# Altium project EPS.PrjPcb (part 4 of 4)

## Sheet EPS_CTRL_B.SchDoc: CTRL-B
size A3; ApprovedBy: (not approved); CheckedBy: (not checked); Author: Piotr Kuligowski; DocumentNumber: PWSat2-xxx-DW-xxx; Revision: 3; SheetNumber: 24; SheetTotal: 51; Model: FPM
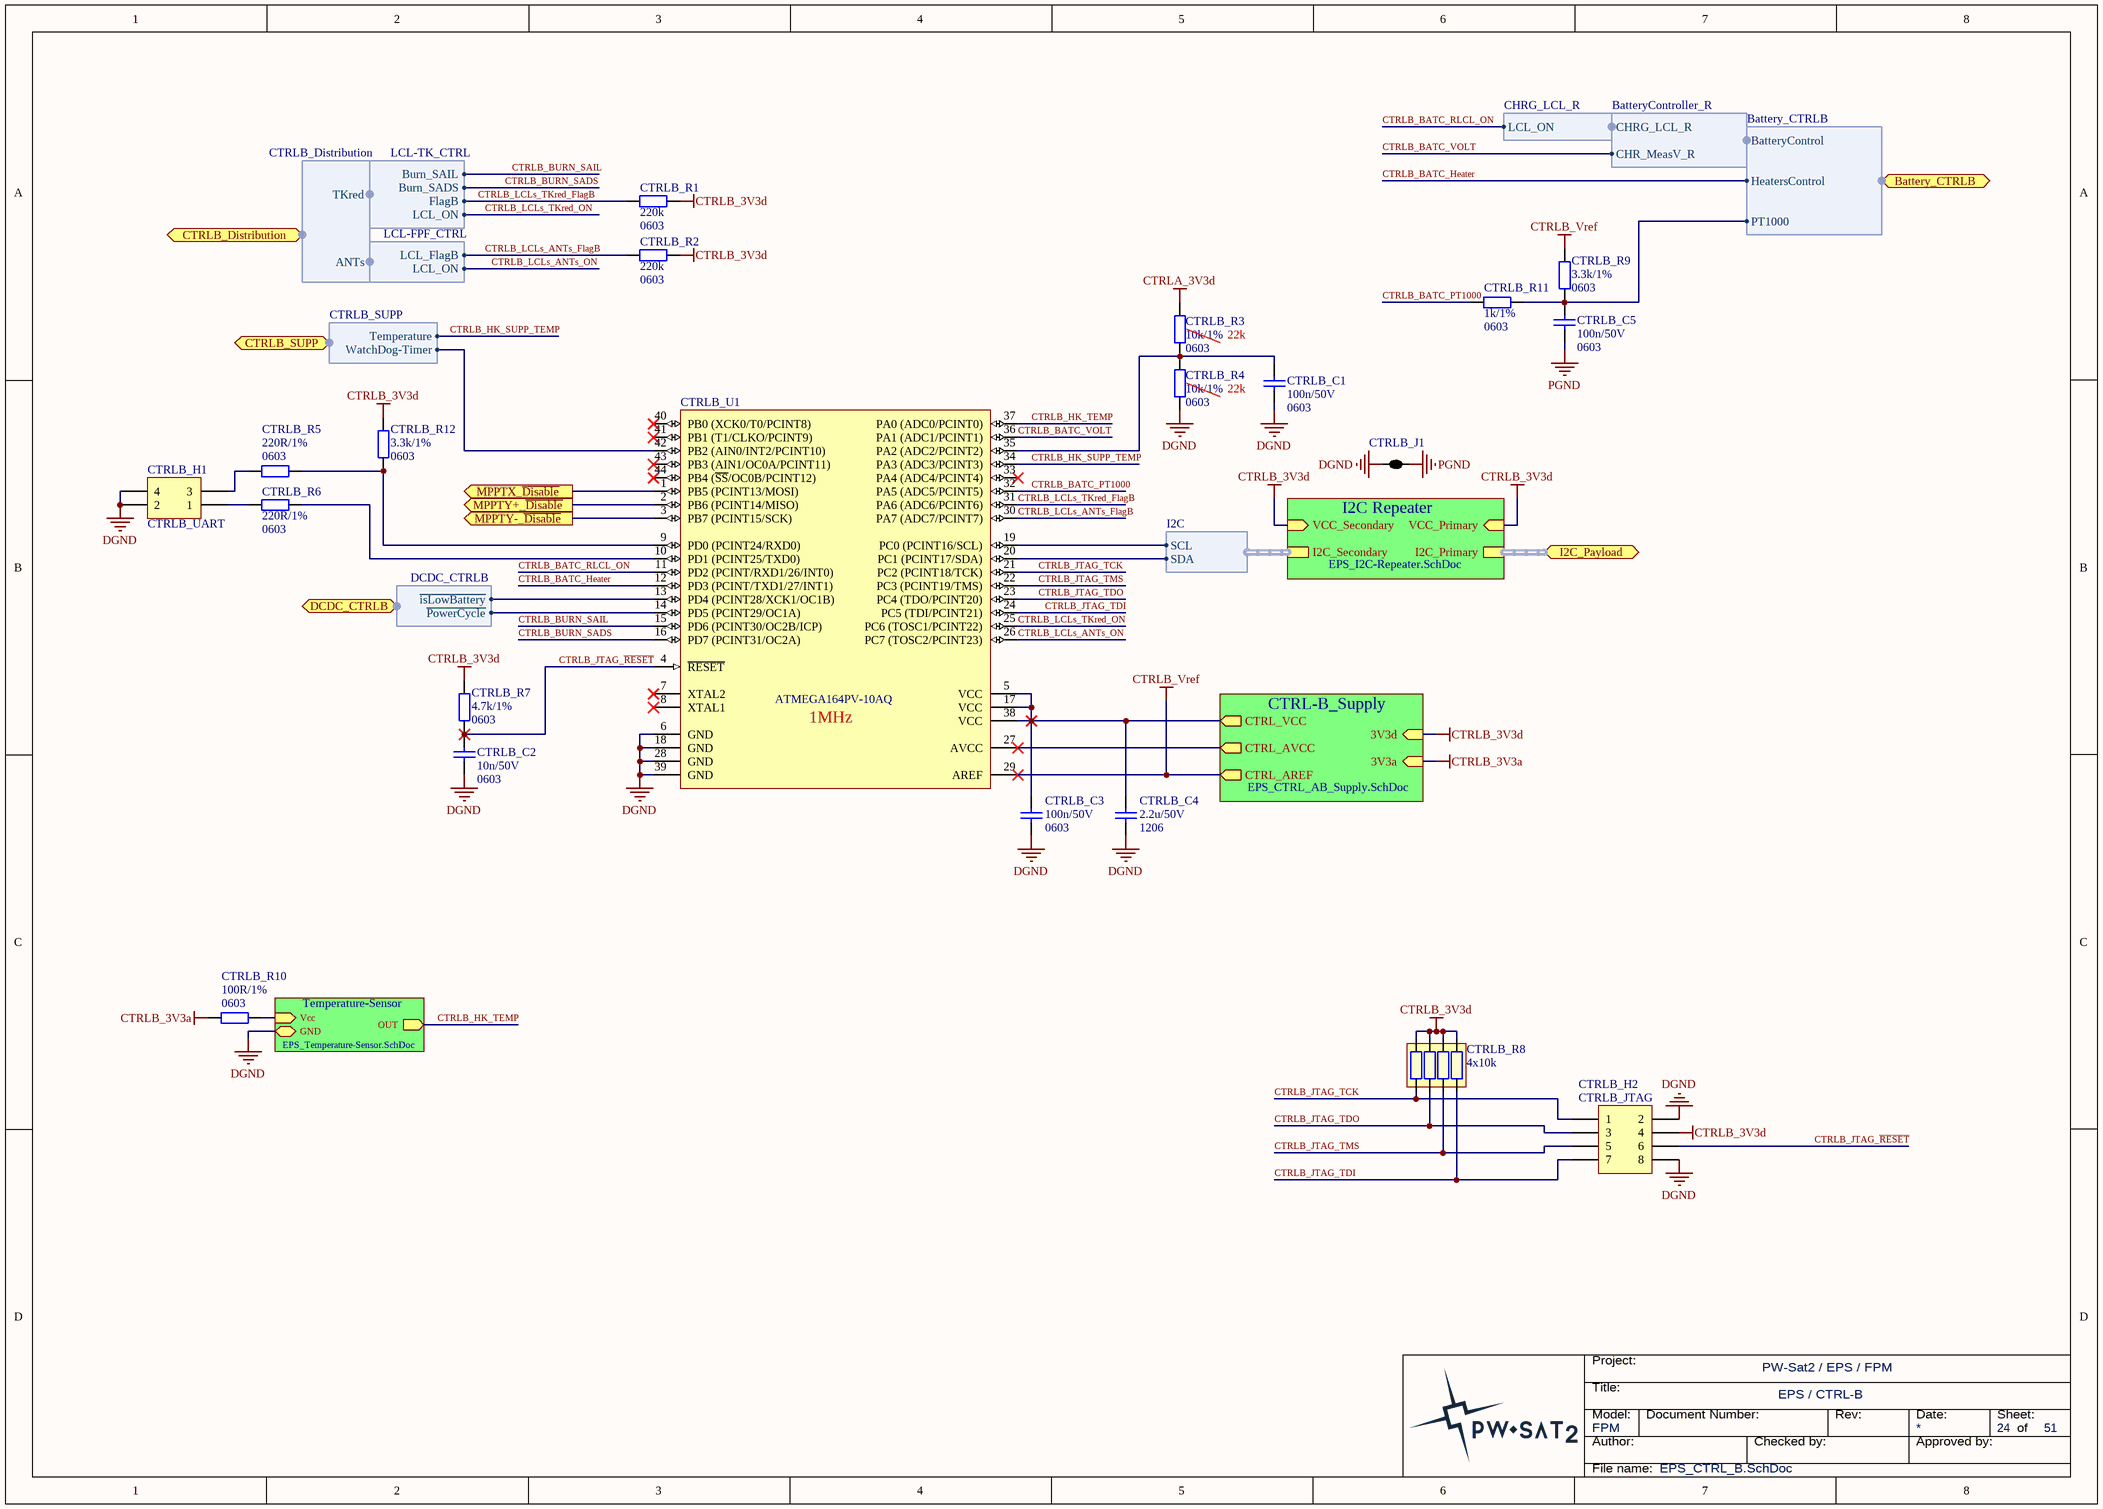
[diagram p38: EPS_CTRL_B.SchDoc]

### Parts
CTRLB_C1  Package: 0603  [SMD_Capacitor_0603]  (hidden comment: 100n/50V)
CTRLB_C2  Package: 0603  [SMD_Capacitor_0603]  (hidden comment: 10n/50V)
CTRLB_C3  Package: 0603  [SMD_Capacitor_0603]  (hidden comment: 100n/50V)
CTRLB_C4  Package: 1206  [SMD_Capacitor_1206]  (hidden comment: 2.2u/50V)
CTRLB_C5  Package: 0603  [SMD_Capacitor_0603]  (hidden comment: 100n/50V)
CTRLB_H1  CTRLB_UART  [Connfly_DS1031-04-2]
CTRLB_H2  CTRLB_JTAG  [Connfly_DS1031-08-2]
CTRLB_J1  2 way net tie junction  [2way_LP]  (value not drawn)  (net tie, no BOM)
CTRLB_R1  Package: 0603  [SMD_Resistor_0603]  (hidden comment: 220k)
CTRLB_R2  Package: 0603  [SMD_Resistor_0603]  (hidden comment: 220k)
CTRLB_R3  Package: 0603  [SMD_Resistor_0603]  (hidden comment: 10k/1%)
CTRLB_R4  Package: 0603  [SMD_Resistor_0603]  (hidden comment: 10k/1%)
CTRLB_R5  Package: 0603  [SMD_Resistor_0603]  (hidden comment: 220R/1%)
CTRLB_R6  Package: 0603  [SMD_Resistor_0603]  (hidden comment: 220R/1%)
CTRLB_R7  Package: 0603  [SMD_Resistor_0603]  (hidden comment: 4.7k/1%)
CTRLB_R8  4x10k  [SMD_RESISTOR_ARRAY_YC124]
CTRLB_R9  Package: 0603  [SMD_Resistor_0603]  (hidden comment: 3.3k/1%)
CTRLB_R10  Package: 0603  [SMD_Resistor_0603]  (hidden comment: 100R/1%)
CTRLB_R11  Package: 0603  [SMD_Resistor_0603]  (hidden comment: 1k/1%)
CTRLB_R12  Package: 0603  [SMD_Resistor_0603]  (hidden comment: 3.3k/1%)
CTRLB_U1  ATMEGA164PV-10AQ  [TQFP-44]

### Sub-sheets
CTRL-B_Supply = EPS_CTRL_AB_Supply.SchDoc: CTRL_VCC (out), CTRL_AVCC (out), CTRL_AREF (out), 3V3d (in), 3V3a (in)
I2C Repeater = EPS_I2C-Repeater.SchDoc: I2C_Primary (harness I2C), I2C_Secondary (harness I2C), VCC_Secondary (in), VCC_Primary (in)
Temperature-Sensor = EPS_Temperature-Sensor.SchDoc: OUT (out), Vcc (in), GND

### Ports
Battery_CTRLB (harness Battery_CTRLB), CTRLB_Distribution (harness CTRLB_Distribution), CTRLB_SUPP (harness CTRLB_SUPP), DCDC_CTRLB (harness DCDC_CTRLB), I2C_Payload (harness I2C), MPPTX_~{Disable} (out), MPPTY+_~{Disable} (out), MPPTY-_~{Disable} (out)

### Harnesses
I2C: SDA, SCL
DCDC_CTRLB: ~{PowerCycle}, ~{isLowBattery}
Battery_CTRLB: BatteryControl, HeatersControl, PT1000
BatteryController_R: CHRG_LCL_R, CHR_MeasV_R
CHRG_LCL_R: LCL_ON
CTRLB_Distribution: TKred, ANTs
LCL-TK_CTRL: FlagB, LCL_ON, Burn_SAIL, Burn_SADS
LCL-FPF_CTRL: LCL_FlagB, LCL_ON
CTRLB_SUPP: Temperature, WatchDog-Timer

### Nets
CTRLA_3V3d: CTRLB_R3.2
CTRLB_3V3a: CTRLB_R10.2 ; sheet CTRL-B_Supply/3V3a
CTRLB_3V3d: CTRLB_C3.1 CTRLB_C4.1 CTRLB_H2.4 CTRLB_R1.1 CTRLB_R2.1 CTRLB_R7.2 CTRLB_R8.1 CTRLB_R8.2 CTRLB_R8.3 CTRLB_R8.4 CTRLB_R12.2 CTRLB_U1.5(VCC) CTRLB_U1.17(VCC) CTRLB_U1.38(VCC) ; sheet I2C Repeater/VCC_Secondary, sheet I2C Repeater/VCC_Primary, sheet CTRL-B_Supply/CTRL_VCC, sheet CTRL-B_Supply/3V3d
CTRLB_Vref: CTRLB_R9.2 CTRLB_U1.29(AREF) ; sheet CTRL-B_Supply/CTRL_AREF
DGND: CTRLB_C1.2 CTRLB_C2.2 CTRLB_C3.2 CTRLB_C4.2 CTRLB_H1.2 CTRLB_H1.4 CTRLB_H2.2 CTRLB_H2.8 CTRLB_J1.2 CTRLB_R4.1 CTRLB_U1.6(GND) CTRLB_U1.18(GND) CTRLB_U1.28(GND) CTRLB_U1.39(GND) ; sheet Temperature-Sensor/GND
PGND: CTRLB_C5.2 CTRLB_J1.1
CTRLB_BATC_Heater: CTRLB_U1.12(PD3_(PCINT/TXD1/27/INT1)) ; port Battery_CTRLB.HeatersControl
CTRLB_BATC_PT1000: CTRLB_R11.2 CTRLB_U1.32(PA5_(ADC5/PCINT5))
CTRLB_BATC_RLCL_ON: CTRLB_U1.11(PD2_(PCINT/RXD1/26/INT0)) ; harness CHRG_LCL_R.LCL_ON  [project net CHRG_LCLR_ON]
CTRLB_BATC_VOLT: CTRLB_U1.36(PA1_(ADC1/PCINT1)) ; harness BatteryController_R.CHR_MeasV_R  [project net BAT_MEAS_VOLTAGE_R]
CTRLB_BURN_SADS: CTRLB_U1.16(PD7_(PCINT31/OC2A)) ; harness LCL-TK_CTRL.Burn_SADS
CTRLB_BURN_SAIL: CTRLB_U1.15(PD6_(PCINT30/OC2B/ICP)) ; harness LCL-TK_CTRL.Burn_SAIL
CTRLB_HK_SUPP_TEMP: CTRLB_U1.34(PA3_(ADC3/PCINT3)) ; port CTRLB_SUPP.Temperature
CTRLB_HK_TEMP: CTRLB_U1.37(PA0_(ADC0/PCINT0)) ; sheet Temperature-Sensor/OUT
CTRLB_JTAG_~{RESET}: CTRLB_C2.1 CTRLB_H2.6 CTRLB_R7.1 CTRLB_U1.4(~{RESET})
CTRLB_JTAG_TCK: CTRLB_H2.1 CTRLB_R8.8 CTRLB_U1.21(PC2_(PCINT18/TCK))
CTRLB_JTAG_TDI: CTRLB_H2.7 CTRLB_R8.5 CTRLB_U1.24(PC5_(TDI/PCINT21))
CTRLB_JTAG_TDO: CTRLB_H2.3 CTRLB_R8.7 CTRLB_U1.23(PC4_(TDO/PCINT20))
CTRLB_JTAG_TMS: CTRLB_H2.5 CTRLB_R8.6 CTRLB_U1.22(PC3_(PCINT19/TMS))
CTRLB_LCLs_ANTs_FlagB: CTRLB_R2.2 CTRLB_U1.30(PA7_(ADC7/PCINT7)) ; harness LCL-FPF_CTRL.LCL_FlagB
CTRLB_LCLs_ANTs_ON: CTRLB_U1.26(PC7_(TOSC2/PCINT23)) ; harness LCL-FPF_CTRL.LCL_ON
CTRLB_LCLs_TKred_FlagB: CTRLB_R1.2 CTRLB_U1.31(PA6_(ADC6/PCINT6)) ; harness LCL-TK_CTRL.FlagB
CTRLB_LCLs_TKred_ON: CTRLB_U1.25(PC6_(TOSC1/PCINT22)) ; harness LCL-TK_CTRL.LCL_ON
NetCTRL_C3_2_1: CTRLB_U1.27(AVCC) ; sheet CTRL-B_Supply/CTRL_AVCC
NetCTRLB_C1_1: CTRLB_C1.1 CTRLB_R3.1 CTRLB_R4.2 CTRLB_U1.35(PA2_(ADC2/PCINT2))
NetCTRLB_C5_1: CTRLB_C5.1 CTRLB_R9.1 CTRLB_R11.1 ; port Battery_CTRLB.PT1000
NetCTRLB_H1_1: CTRLB_H1.1 CTRLB_R6.1
NetCTRLB_H1_3: CTRLB_H1.3 CTRLB_R5.1
NetCTRLB_R5_2: CTRLB_R5.2 CTRLB_R12.1 CTRLB_U1.9(PD0_(PCINT24/RXD0))
NetCTRLB_R6_2: CTRLB_R6.2 CTRLB_U1.10(PD1_(PCINT25/TXD0))
NetCTRLB_R10_1: CTRLB_R10.1 ; sheet Temperature-Sensor/Vcc
NetCTRLB_U1_1: CTRLB_U1.1(PB5_(PCINT13/MOSI)) ; port MPPTX_~{Disable}
NetCTRLB_U1_2: CTRLB_U1.2(PB6_(PCINT14/MISO)) ; port MPPTY+_~{Disable}
NetCTRLB_U1_3: CTRLB_U1.3(PB7_(PCINT15/SCK)) ; port MPPTY-_~{Disable}
NetCTRLB_U1_13: CTRLB_U1.13(PD4_(PCINT28/XCK1/OC1B)) ; port DCDC_CTRLB.~{isLowBattery}
NetCTRLB_U1_14: CTRLB_U1.14(PD5_(PCINT29/OC1A)) ; port DCDC_CTRLB.~{PowerCycle}
NetCTRLB_U1_19: CTRLB_U1.19(PC0_(PCINT16/SCL)) ; sheet I2C Repeater/I2C_Secondary.SCL
NetCTRLB_U1_20: CTRLB_U1.20(PC1_(PCINT17/SDA)) ; sheet I2C Repeater/I2C_Secondary.SDA
NetCTRLB_U1_42: CTRLB_U1.42(PB2_(AIN0/INT2/PCINT10)) ; port CTRLB_SUPP.WatchDog-Timer

Not connected (* = marked no-connect by the designer): CTRLB_U1 7(XTAL2)* 8(XTAL1)* 33(PA4_(ADC4/PCINT4))* 40(PB0_(XCK0/T0/PCINT8))* 41(PB1_(T1/CLKO/PCINT9))* 43(PB3_(AIN1/OC0A/PCINT11))* 44(PB4_(~{SS}/OC0B/PCINT12))*

### Buses and harness runs
harness port I2C_Payload = sheet I2C Repeater/I2C_Primary

### Notes on the sheet
- 22k
- (near CTRLB_U1) 1MHz
- Title:
- Project:
- Author:
- Model:
- Document Number:
- Checked by:
- Rev:
- Date:
- Approved by:
- Sheet:
- of
- File name:

### Library data of the parts
CTRLB_C1-CTRLB_C3 CTRLB_C5 = Cer_C0603T104K5RALTU: Ceramic Cap Kemet COTS 100n/50V X7R 0603; Manufacturer: Kemet; ManufacturerPartNumber: C0603T104K5RALTU
  CTRLB_C1 CTRLB_C3 CTRLB_C5: Value: 100n/50V
  CTRLB_C2: Value: 10n/50V
CTRLB_C4 = Cer_GCJ31CR71H225KA12L: Ceramic Cap Murata Automotive 2.2u/50V X7R 1206; Manufacturer: Murata; ManufacturerPartNumber: GCJ31CR71H225KA12L; Value: 2.2u/50V
CTRLB_H1 = Header 2X2: Header, 2-Pin, Dual row; LatestRevisionDate: 17-Jul-2002; LatestRevisionNote: Re-released for DXP Platform.; Publisher: Altium Limited
CTRLB_H2 = Header 4X2: Header, 4-Pin, Dual row; LatestRevisionDate: 17-Jul-2002; LatestRevisionNote: Re-released for DXP Platform.; Publisher: Altium Limited
CTRLB_J1 = 2way: ComponentLink1URL: http://www.edatools.cz/addons; ComponentLink1Description: Source; FootprintNote: LP=12mil, MP=40mil, HP=120mil
CTRLB_R1-CTRLB_R7 CTRLB_R9 CTRLB_R11 CTRLB_R12 = CRCW06034K70FKxxxx: 4.7k/1% Vishay CRCW 0603 Resistor. 100mW, 100ppm, 75V.; Manufacturer: Vishay; ManufactuerPartNumber: CRCW06034K70FKxxxx
  CTRLB_R1 CTRLB_R2: Value: 220k
  CTRLB_R3 CTRLB_R4: Value: 10k/1%
  CTRLB_R5 CTRLB_R6: Value: 220R/1%
  CTRLB_R7: Value: 4.7k/1%
  CTRLB_R9 CTRLB_R12: Value: 3.3k/1%
  CTRLB_R11: Value: 1k/1%
CTRLB_R8 = YC124-JR-072K2L: RESISTOR ARRAY, 4 x 0402; URL: http://pl.farnell.com/yageo-phycomp/yc124-jr-072k2l/resistor-array-arv341-4-x-0402/dp/9235388
CTRLB_R10 = CRCW06031K00FKxxxx: 1k/1% Vishay CRCW 0603 Resistor. 100mW, 100ppm, 75V.; Manufacturer: Vishay; ManufacturerPartNumber: CRCW06031K00FKxxxx; Value: 100R/1%
CTRLB_U1 = ATMEGA164PV-10AQ: General-purpose microcontroller; Value: ATMEGA164PV-10AQ

## Sheet EPS_Connectors_PC-104.SchDoc: Connectors / PC-104
size A4; ApprovedBy: (not approved); CheckedBy: (not checked); Author: Piotr Kuligowski; DocumentNumber: PWSat2-xxx-DW-xxx; Revision: 3; SheetNumber: 2; SheetTotal: 51; Model: FPM
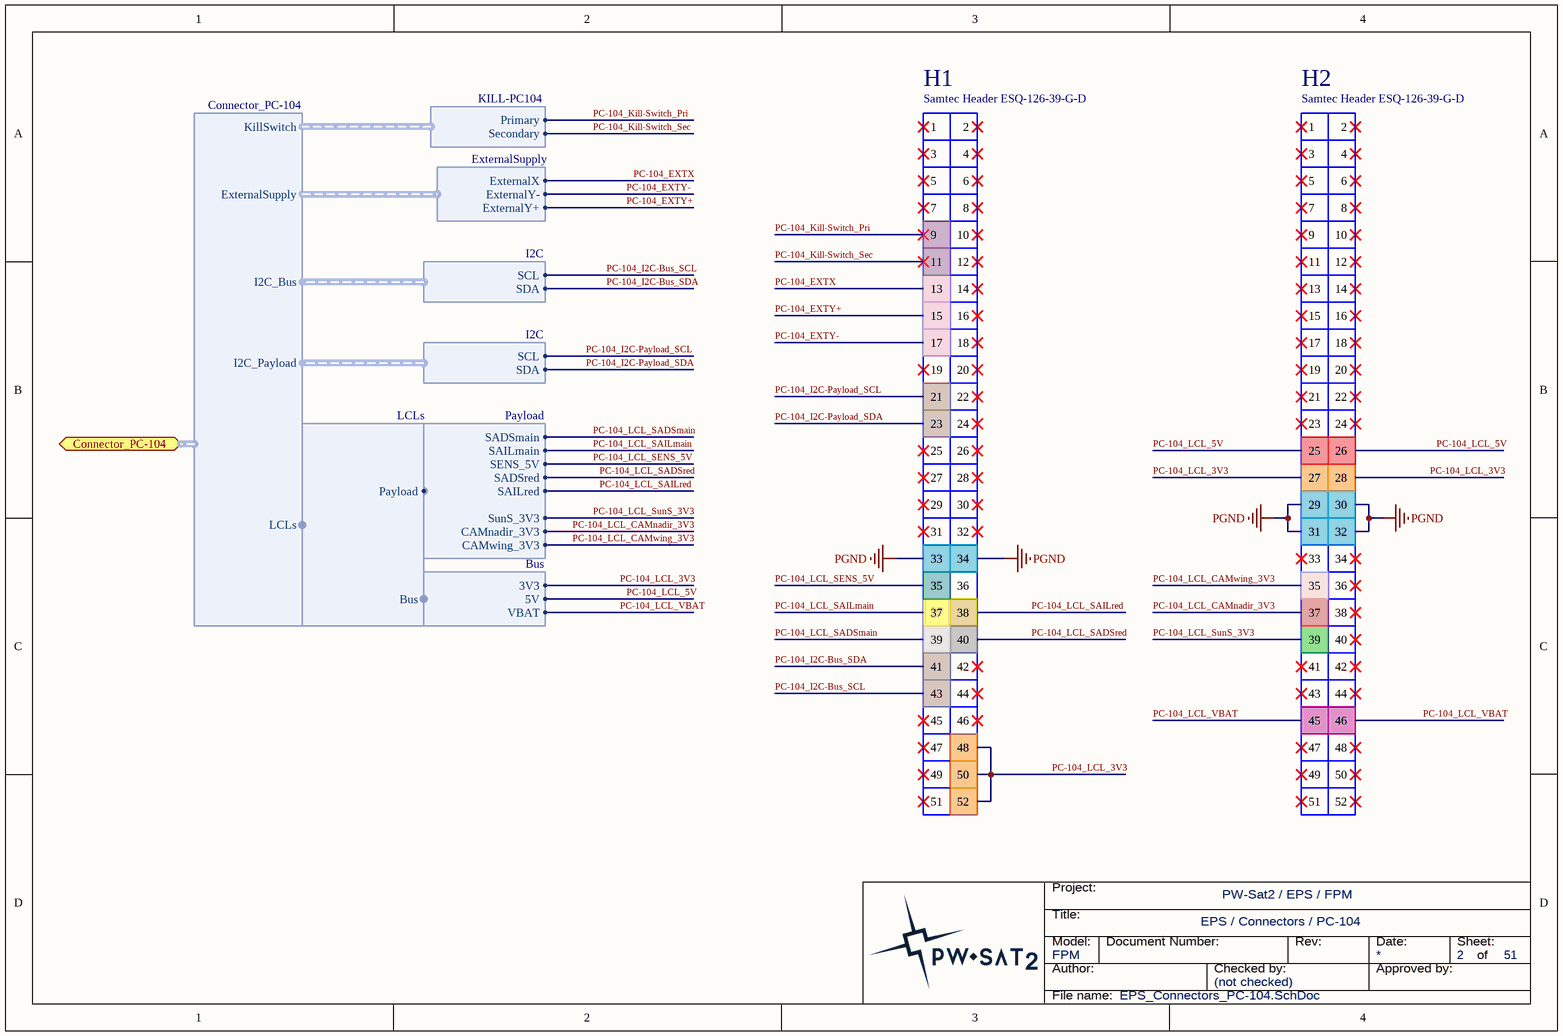
[diagram p39: EPS_Connectors_PC-104.SchDoc]

### Parts
H1  Samtec Header ESQ-126-39-G-D  [Samtec_ESQ-126-39-G-D]
H2  Samtec Header ESQ-126-39-G-D  [Samtec_ESQ-126-39-G-D]

### Ports
Connector_PC-104 (harness Connector_PC-104)

### Harnesses
Connector_PC-104: I2C_Payload, LCLs, I2C_Bus, ExternalSupply, KillSwitch
Payload: SADSred, SAILred, SENS_5V, SAILmain, SADSmain, SunS_3V3, CAMnadir_3V3, CAMwing_3V3
I2C: SDA, SCL
LCLs: Payload, Bus
Bus: 3V3, 5V, VBAT
ExternalSupply: ExternalX, ExternalY-, ExternalY+
KILL-PC104: Secondary, Primary

### Nets
PGND: H1.33 H1.34 H2.29 H2.30 H2.31 H2.32
PC-104_EXTX: H1.13 ; harness ExternalSupply.ExternalX
PC-104_EXTY+: H1.15 ; harness ExternalSupply.ExternalY+
PC-104_EXTY-: H1.17 ; harness ExternalSupply.ExternalY-
PC-104_I2C-Bus_SCL: H1.43 ; harness I2C.SCL
PC-104_I2C-Bus_SDA: H1.41 ; harness I2C.SDA
PC-104_I2C-Payload_SCL: H1.21 ; harness I2C.SCL
PC-104_I2C-Payload_SDA: H1.23 ; harness I2C.SDA
PC-104_Kill-Switch_Pri: H1.9 ; harness KILL-PC104.Primary
PC-104_Kill-Switch_Sec: H1.11 ; harness KILL-PC104.Secondary
PC-104_LCL_3V3: H1.48 H1.50 H1.52 H2.27 H2.28 ; harness Bus.3V3
PC-104_LCL_5V: H2.25 H2.26 ; harness Bus.5V
PC-104_LCL_CAMnadir_3V3: H2.37 ; harness Payload.CAMnadir_3V3
PC-104_LCL_CAMwing_3V3: H2.35 ; harness Payload.CAMwing_3V3
PC-104_LCL_SADSmain: H1.39 ; harness Payload.SADSmain
PC-104_LCL_SADSred: H1.40 ; harness Payload.SADSred
PC-104_LCL_SAILmain: H1.37 ; harness Payload.SAILmain
PC-104_LCL_SAILred: H1.38 ; harness Payload.SAILred
PC-104_LCL_SENS_5V: H1.35 ; harness Payload.SENS_5V
PC-104_LCL_SunS_3V3: H2.39 ; harness Payload.SunS_3V3
PC-104_LCL_VBAT: H2.45 H2.46 ; harness Bus.VBAT

Not connected (* = marked no-connect by the designer): H1 1* 2* 3* 4* 5* 6* 7* 8* 10* 12* 14* 16* 18* 19* 20* 22* 24* 25* 26* 27* 28* 29* 30* 31* 32* 36 42* 44* 45* 46* 47* 49* 51*; H2 1* 2* 3* 4* 5* 6* 7* 8* 9* 10* 11* 12* 13* 14* 15* 16* 17* 18* 19* 20* 21* 22* 23* 24* 33* 34* 36* 38* 40* 41* 42* 43* 44* 47* 48* 49* 50* 51* 52*

### Notes on the sheet
- Title:
- Project:
- Author:
- Model:
- Document Number:
- Checked by:
- Rev:
- Date:
- Approved by:
- Sheet:
- of
- File name:

### Library data of the parts
H1 H2 = Samtec_ESQ-126-xx-x-D: Samtec ESQ Series Header , 2.54mm pitch, 2x26pin. PC-104 Stack Connector.; HelpUrl: http://suddendocs.samtec.com/catalog_english/esq_th.pdf; Value: Samtec Header ESQ-126-39-G-D

## Nets that join several sheets
AGND: Top/MPPT X/MPPTX Interface to uC (18 pins), Top/MPPT Y+/MPPTY Interface to uC (18 pins), Top/MPPT Y-/MPPTY Interface to uC (18 pins)
CTRLA_3V3a: EPS_CTRL_A (8 pins), Top/Controller A/CTRL-A_Supply (CTRL_FB1_1.1 CTRL_FB2_1.1), Top/MPPT X/MPPTX Measurements (MEAS_R3_1.1), Top/MPPT Y+/MPPTY Measurements (MEAS_R3_2.1), EPS_3V3 (TEMP_R4.2), EPS_5V (TEMP_R1.2), Top/Distribution/5V Measurements (HK_R2_1.1), Top/Distribution/3V3 Measurements (HK_R2_2.1), Top/Distribution/VBAT Measurements (HK_R2_3.1), Top/Local-Supply and WDTs/Local-Supply CTRL-A (LS_FB1_1.2 SUPP_C1_1.1 SUPP_C2_1.1 TEMP_R5_1.2), EPS_Battery (TEMP_R2.2), Top/MPPT Y-/MPPTY Measurements (MEAS_R3_3.1)
CTRLA_3V3d: EPS_CTRL_A (20 pins), Top/Controller A/I2C Repeater (9 pins), Top/Controller A/CTRL-A_Supply (CTRL_C1_1.1 CTRL_C2_1.1 CTRL_C8_1.1 CTRL_C9_1.1), EPS_DCDC_RLCLs (SEL_C2.1 SEL_R10.2 SEL_U1.5), EPS_Local-Supply (LS_D1.A LS_R9.2), Top/Local-Supply and WDTs/Local-Supply CTRL-A (SUPP_C5_1.1 SUPP_C6_1.1 SUPP_R2_1.1 SUPP_U3_1.6), EPS_Battery_Controller_Current-Meas (BATC_R3.1 BATC_R4.1), EPS_Battery_Heaters-Control (HTR_R1.2), EPS_CTRL_B (CTRLB_R3.2)
CTRLAB_3V3d: Top/Distribution/LCL-FPF SunS 3V3 (LCL_R2_1.1), Top/Distribution/LCL-FPF CAMnadir 3V3 (LCL_R2_2.1), Top/Distribution/LCL-FPF CAMwing 3V3 (LCL_R2_3.1), Top/Distribution/LCL-TK MAIN (LCLTK_R6_1.1), Top/Distribution/LCL-TK Redundant (LCLTK_R6_2.1), Top/Distribution/LCL-FPF SENS 5V (LCL_R2_4.1), Top/Distribution/LCL-FPF ANTs 5V (LCL_R2_5.1), Top/Distribution/LCL-FPF ANTs 5V (LCL_R2_6.1), EPS_DCDC_RLCLs (SEL_R1.2), EPS_Local-Supply (LS_R7.2 LS_R8.1 LS_R10.2), EPS_Battery_Controller_RLCL (RLCLB_R1.2)
CTRLB_3V3a: Top/Local-Supply and WDTs/Local-Supply CTRL-B (LS_FB1_2.2 SUPP_C1_2.1 SUPP_C2_2.1 TEMP_R5_2.2), EPS_CTRL_B (CTRLB_R10.2), Top/Controller B/CTRL-B_Supply (CTRL_FB1_2.1 CTRL_FB2_2.1)
CTRLB_3V3d: EPS_CTRL_A (CTRLA_R14.2), EPS_DCDC_RLCLs (SEL_C3.1 SEL_R11.2 SEL_U2.5), EPS_Local-Supply (LS_D2.A LS_R11.2), Top/Local-Supply and WDTs/Local-Supply CTRL-B (SUPP_C5_2.1 SUPP_C6_2.1 SUPP_R2_2.1 SUPP_U3_2.6), EPS_Battery_Heaters-Control (HTR_R7.2), EPS_CTRL_B (14 pins), Top/Controller B/I2C Repeater (9 pins), Top/Controller B/CTRL-B_Supply (CTRL_C1_2.1 CTRL_C2_2.1 CTRL_C8_2.1 CTRL_C9_2.1)
CTRLB_Vref: EPS_CTRL_B (CTRLB_R9.2 CTRLB_U1.29), Top/Controller B/CTRL-B_Supply (CTRL_C5_2.1 CTRL_C6_2.1 CTRL_R1_2.1 CTRL_REF1_2.1)
DGND: EPS_CTRL_A (21 pins), Top/Controller A/I2C Repeater (5 pins), Top/Controller A/CTRL-A_Supply (12 pins), Top/Controller A/Temperature-Sensor (TEMP_C1_1.2 TEMP_U1_1.2), Top/Distribution/5V Measurements (HK_C4_1.2), Top/Distribution/3V3 Measurements (HK_C4_2.2), Top/Distribution/VBAT Measurements (HK_C4_3.2), EPS_Local-Supply (LS_R9.1 LS_R10.1 LS_R11.1), EPS_CTRL_B (14 pins), Top/Controller B/I2C Repeater (5 pins), Top/Controller B/Temperature-Sensor (TEMP_C1_7.2 TEMP_U1_7.2), Top/Controller B/CTRL-B_Supply (12 pins)
PGND: EPS_Connectors (20 pins), Top/Controller A/CTRL-A_Supply (CTRL_J1_1.1), EPS_MPPT_X_Boost-Converter (13 pins), Top/MPPT X/MPPTX Interface to uC (MPPT_C10_1.2 MPPT_J1_1.1 MPPT_U4_1.2), Top/MPPT X/MPPTX Measurements (5 pins), EPS_MPPT_X_EMI-Filter_In (EMIXI_C1.2 EMIXI_C2.2), EPS_MPPT_X_OR_MPB (SUMPBX_C4.2 SUMPBX_R4.2 SUMPBX_R6.2), Top/MPPT Y+/MPPTY Buck-Boost Converter (20 pins), Top/MPPT Y+/MPPTY EMI Filters for Solar Panels (EMIYS_C1_1.2 EMIYS_C2_1.2 EMIYS_T1_1.3), Top/MPPT Y+/MPPTY Interface to uC (MPPT_C10_2.2 MPPT_J1_2.1 MPPT_U4_2.2), Top/MPPT Y+/MPPTY Measurements (5 pins), Top/MPPT Y+/MPPTY Input EMI Filter (EMIYI_C1_1.2 EMIYI_C2_1.2), Top/MPPT Y+/MPPTY Output EMI Filter (EMIYO_C1_1.2 EMIYO_C2_1.2 EMIYO_C3_1.2), Top/MPPT Y+/MPPTY ORing to MPB (5 pins), Top/3V3/Temperature-Sensor (TEMP_C1_2.2 TEMP_U1_2.2), EPS_5V_EMI-Filter_Out (EMIBB_C2.2 EMIBB_C3.2 EMIBB_C4.2), Top/5V/Temperature-Sensor (TEMP_C1_3.2 TEMP_U1_3.2), EPS_RBL (RBL_C2.2 RBL_C4.2 RBL_Q2.E RBL_Q4.E), EPS_Distribution (8 pins), Top/Distribution/LCL-FPF SunS 3V3 (LCL_C2_1.2 LCL_C3_1.2 LCL_R3_1.1 LCL_R5_1.1), Top/Distribution/LCL-FPF CAMnadir 3V3 (LCL_C2_2.2 LCL_C3_2.2 LCL_R3_2.1 LCL_R5_2.1), Top/Distribution/LCL-FPF CAMwing 3V3 (LCL_C2_3.2 LCL_C3_3.2 LCL_R3_3.1 LCL_R5_3.1), Top/Distribution/LCL-TK MAIN (10 pins), Top/Distribution/LCL-TK Redundant (10 pins), Top/Distribution/LCL-FPF SENS 5V (LCL_C2_4.2 LCL_C3_4.2 LCL_R3_4.1 LCL_R5_4.1), Top/Distribution/RLCL-FPF 5V (6 pins), Top/Distribution/5V Measurements (5 pins), Top/Distribution/3V3 Measurements (5 pins), Top/Distribution/VBAT Measurements (5 pins), Top/Distribution/LCL-FPF ANTs 5V (LCL_C2_5.2 LCL_C3_5.2 LCL_R3_5.1 LCL_R5_5.1), Top/Distribution/RLCL-FPF 3V3 (6 pins), Top/Distribution/LCL-FPF ANTs 5V (LCL_C2_6.2 LCL_C3_6.2 LCL_R3_6.1 LCL_R5_6.1), EPS_DCDC_RLCLs (13 pins), Top/LCLs for DCDC/DCDC RLCL (DRLCL_C4_1.2 DRLCL_C5_1.2 DRLCL_R4_1.1 DRLCL_R5_1.2), Top/LCLs for DCDC/VBAT RLCL (DRLCL_C4_2.2 DRLCL_C5_2.2 DRLCL_R4_2.1 DRLCL_R5_2.2), EPS_Local-Supply (LS_C2.2 LS_R4.2), Top/Local-Supply and WDTs/Local-Supply CTRL-A (18 pins), Top/Local-Supply and WDTs/Local-Supply CTRL-A/Temperature-Sensor (TEMP_C1_4.2 TEMP_U1_4.2), Top/Local-Supply and WDTs/Local-Supply CTRL-B (18 pins), Top/Local-Supply and WDTs/Local-Supply CTRL-B/Temperature-Sensor (TEMP_C1_5.2 TEMP_U1_5.2), EPS_Battery_Controller_Current-Meas (BATC_R2.2 BATC_R5.1), EPS_Battery_Controller_Voltage-Meas (BATV_C1.2 BATV_C2.2 BATV_R2.2 BATV_R4.2), EPS_Battery_Controller_RLCL (9 pins), EPS_Battery_Heaters-Control (HTR_Q2.E HTR_Q3.S HTR_R3.1), Top/Battery Pack/Temperature-Sensor (TEMP_C1_6.2 TEMP_U1_6.2), Top/MPPT Y-/MPPTY Buck-Boost Converter (20 pins), Top/MPPT Y-/MPPTY EMI Filters for Solar Panels (EMIYS_C1_2.2 EMIYS_C2_2.2 EMIYS_T1_2.3), Top/MPPT Y-/MPPTY Interface to uC (MPPT_C10_3.2 MPPT_J1_3.1 MPPT_U4_3.2), Top/MPPT Y-/MPPTY Measurements (5 pins), Top/MPPT Y-/MPPTY Input EMI Filter (EMIYI_C1_2.2 EMIYI_C2_2.2), Top/MPPT Y-/MPPTY Output EMI Filter (EMIYO_C1_2.2 EMIYO_C2_2.2 EMIYO_C3_2.2), Top/MPPT Y-/MPPTY ORing to MPB (5 pins), EPS_CTRL_B (CTRLB_C5.2 CTRLB_J1.1), Top/Controller B/CTRL-B_Supply (CTRL_J1_2.1), EPS_Connectors_PC-104 (6 pins)
BAT_MEAS_VOLTAGE_N: EPS_CTRL_A (CTRLA_U3.10), EPS_Battery_Controller_Voltage-Meas (BATV_C1.1 BATV_R1.2 BATV_R2.1)
BAT_MEAS_VOLTAGE_R: EPS_Battery_Controller_Voltage-Meas (BATV_C2.1 BATV_R3.2 BATV_R4.1), EPS_CTRL_B (CTRLB_U1.36)
CHRG_LCLN_ON: EPS_CTRL_A (U4.33), EPS_Battery_Controller_RLCL (RLCLB_R10.1)
CHRG_LCLR_ON: EPS_Battery_Controller_RLCL (RLCLB_R9.1), EPS_CTRL_B (CTRLB_U1.11)
CHRG_MEAS_CURRENT: EPS_CTRL_A (CTRLA_U3.12), EPS_Battery_Controller_Current-Meas (BATC_U1.2)
CTRLA_BATC_CURR_DCHRG: EPS_CTRL_A (CTRLA_U3.11), EPS_Battery_Controller_Current-Meas (BATC_U2.2)
CTRLA_BATC_Heater: EPS_CTRL_A (U4.34), EPS_Battery_Heaters-Control (HTR_R8.2)
CTRLA_BATC_TEMP: EPS_CTRL_A (CTRLA_U3.13), Top/Battery Pack/Temperature-Sensor (TEMP_R1_6.2)
CTRLA_BURN_SADS: EPS_CTRL_A (U4.42), Top/Distribution/LCL-TK MAIN (LCLTK_R11_1.2 LCLTK_R12_1.2)
CTRLA_BURN_SAIL: EPS_CTRL_A (U4.41), Top/Distribution/LCL-TK MAIN (LCLTK_R3_1.2 LCLTK_R5_1.2)
CTRLA_HK_3V3_CURR: EPS_CTRL_A (CTRLA_U2.6), Top/Distribution/3V3 Measurements (HK_C4_2.1 HK_R5_2.2)
CTRLA_HK_3V3_TEMP: EPS_CTRL_A (CTRLA_U2.11), Top/3V3/Temperature-Sensor (TEMP_R1_2.2)
CTRLA_HK_3V3_VOLT: EPS_CTRL_A (CTRLA_U2.7), Top/Distribution/3V3 Measurements (HK_C1_2.1 HK_R3_2.2 HK_R4_2.1)
CTRLA_HK_5V_CURR: EPS_CTRL_A (CTRLA_U2.13), Top/Distribution/5V Measurements (HK_C4_1.1 HK_R5_1.2)
CTRLA_HK_5V_TEMP: EPS_CTRL_A (CTRLA_U2.10), Top/5V/Temperature-Sensor (TEMP_R1_3.2)
CTRLA_HK_5V_VOLT: EPS_CTRL_A (CTRLA_U2.12), Top/Distribution/5V Measurements (HK_C1_1.1 HK_R3_1.2 HK_R4_1.1)
CTRLA_HK_SUPP_TEMP: EPS_CTRL_A (CTRLA_U3.7), Top/Local-Supply and WDTs/Local-Supply CTRL-A/Temperature-Sensor (TEMP_R1_4.2)
CTRLA_HK_TEMP: EPS_CTRL_A (CTRLA_U3.5), Top/Controller A/Temperature-Sensor (TEMP_R1_1.2)
CTRLA_HK_VBAT_CURR: EPS_CTRL_A (CTRLA_U2.4), Top/Distribution/VBAT Measurements (HK_C4_3.1 HK_R5_3.2)
CTRLA_HK_VBAT_VOLT: EPS_CTRL_A (CTRLA_U2.5), Top/Distribution/VBAT Measurements (HK_C1_3.1 HK_R3_3.2 HK_R4_3.1)
CTRLA_LCLs_ANTs_FlagB: EPS_CTRL_A (CTRLA_R12.2 U4.46), Top/Distribution/LCL-FPF ANTs 5V (LCL_U1_5.7)
CTRLA_LCLs_ANTs_ON: EPS_CTRL_A (U4.40), Top/Distribution/LCL-FPF ANTs 5V (LCL_R4_5.2)
CTRLA_LCLs_CAMnadir_FlagB: EPS_CTRL_A (CTRLA_R8.2 U4.49), Top/Distribution/LCL-FPF CAMnadir 3V3 (LCL_U1_2.7)
CTRLA_LCLs_CAMnadir_ON: EPS_CTRL_A (U4.37), Top/Distribution/LCL-FPF CAMnadir 3V3 (LCL_R4_2.2)
CTRLA_LCLs_CAMwing_FlagB: EPS_CTRL_A (CTRLA_R9.2 U4.48), Top/Distribution/LCL-FPF CAMwing 3V3 (LCL_U1_3.7)
CTRLA_LCLs_CAMwing_ON: EPS_CTRL_A (U4.38), Top/Distribution/LCL-FPF CAMwing 3V3 (LCL_R4_3.2)
CTRLA_LCLs_SENS_FlagB: EPS_CTRL_A (CTRLA_R10.2 U4.47), Top/Distribution/LCL-FPF SENS 5V (LCL_U1_4.7)
CTRLA_LCLs_SENS_ON: EPS_CTRL_A (U4.39), Top/Distribution/LCL-FPF SENS 5V (LCL_R4_4.2)
CTRLA_LCLs_Suns_FlagB: EPS_CTRL_A (CTRLA_R5.2 U4.50), Top/Distribution/LCL-FPF SunS 3V3 (LCL_U1_1.7)
CTRLA_LCLs_SunS_ON: EPS_CTRL_A (U4.36), Top/Distribution/LCL-FPF SunS 3V3 (LCL_R4_1.2)
CTRLA_LCLs_TKmain_FlagB: EPS_CTRL_A (CTRLA_R2.2 U4.51), Top/Distribution/LCL-TK MAIN (LCLTK_U1_1.7)
CTRLA_LCLs_TKmain_ON: EPS_CTRL_A (U4.35), Top/Distribution/LCL-TK MAIN (LCLTK_R13_1.2)
CTRLB_BATC_Heater: EPS_Battery_Heaters-Control (HTR_R6.1), EPS_CTRL_B (CTRLB_U1.12)
CTRLB_BURN_SADS: Top/Distribution/LCL-TK Redundant (LCLTK_R11_2.2 LCLTK_R12_2.2), EPS_CTRL_B (CTRLB_U1.16)
CTRLB_BURN_SAIL: Top/Distribution/LCL-TK Redundant (LCLTK_R3_2.2 LCLTK_R5_2.2), EPS_CTRL_B (CTRLB_U1.15)
CTRLB_HK_SUPP_TEMP: Top/Local-Supply and WDTs/Local-Supply CTRL-B/Temperature-Sensor (TEMP_R1_5.2), EPS_CTRL_B (CTRLB_U1.34)
CTRLB_HK_TEMP: EPS_CTRL_B (CTRLB_U1.37), Top/Controller B/Temperature-Sensor (TEMP_R1_7.2)
CTRLB_LCLs_ANTs_FlagB: Top/Distribution/LCL-FPF ANTs 5V (LCL_U1_6.7), EPS_CTRL_B (CTRLB_R2.2 CTRLB_U1.30)
CTRLB_LCLs_ANTs_ON: Top/Distribution/LCL-FPF ANTs 5V (LCL_R4_6.2), EPS_CTRL_B (CTRLB_U1.26)
CTRLB_LCLs_TKred_FlagB: Top/Distribution/LCL-TK Redundant (LCLTK_U1_2.7), EPS_CTRL_B (CTRLB_R1.2 CTRLB_U1.31)
CTRLB_LCLs_TKred_ON: Top/Distribution/LCL-TK Redundant (LCLTK_R13_2.2), EPS_CTRL_B (CTRLB_U1.25)
MPPT_3V3a: EPS_CTRL_A (CTRLA_J1.1), Top/MPPT X/MPPTX Interface to uC (12 pins)
MPPT_3V3a: EPS_CTRL_A (CTRLA_J2.1), Top/MPPT Y+/MPPTY Interface to uC (12 pins)
MPPT_3V3a: EPS_CTRL_A (CTRLA_J4.1), Top/MPPT Y-/MPPTY Interface to uC (12 pins)
MPPT_CS_ADC: EPS_CTRL_A (CTRLA_R1.1), Top/MPPT X/MPPTX Interface to uC (MPPT_U3_1.1)
MPPT_CS_ADC: EPS_CTRL_A (CTRLA_R11.2), Top/MPPT Y+/MPPTY Interface to uC (MPPT_U3_2.1)
MPPT_CS_ADC: EPS_CTRL_A (CTRLA_R24.2), Top/MPPT Y-/MPPTY Interface to uC (MPPT_U3_3.1)
MPPT_CS_DAC: EPS_CTRL_A (CTRLA_R1.2), Top/MPPT X/MPPTX Interface to uC (MPPT_U2_1.6)
MPPT_CS_DAC: EPS_CTRL_A (CTRLA_R11.4), Top/MPPT Y+/MPPTY Interface to uC (MPPT_U2_2.6)
MPPT_CS_DAC: EPS_CTRL_A (CTRLA_R24.1), Top/MPPT Y-/MPPTY Interface to uC (MPPT_U2_3.6)
MPPT_DIN: EPS_CTRL_A (CTRLA_R1.3), Top/MPPT X/MPPTX Interface to uC (MPPT_U2_1.4 MPPT_U3_1.8)
MPPT_DIN: EPS_CTRL_A (CTRLA_R11.3), Top/MPPT Y+/MPPTY Interface to uC (MPPT_U2_2.4 MPPT_U3_2.8)
MPPT_DIN: EPS_CTRL_A (CTRLA_R24.4), Top/MPPT Y-/MPPTY Interface to uC (MPPT_U2_3.4 MPPT_U3_3.8)
MPPT_DOUT: EPS_CTRL_A (CTRLA_R1.4), Top/MPPT X/MPPTX Interface to uC (MPPT_U3_1.9)
MPPT_DOUT: EPS_CTRL_A (CTRLA_R11.1), Top/MPPT Y+/MPPTY Interface to uC (MPPT_U3_2.9)
MPPT_DOUT: EPS_CTRL_A (CTRLA_R24.3), Top/MPPT Y-/MPPTY Interface to uC (MPPT_U3_3.9)
MPPT_Meas_I: Top/MPPT X/MPPTX Interface to uC (MPPT_R10_1.2), Top/MPPT X/MPPTX Measurements (MEAS_U1_1.2)
MPPT_Meas_I: Top/MPPT Y+/MPPTY Interface to uC (MPPT_R10_2.2), Top/MPPT Y+/MPPTY Measurements (MEAS_U1_2.2)
MPPT_Meas_I: Top/MPPT Y-/MPPTY Interface to uC (MPPT_R10_3.2), Top/MPPT Y-/MPPTY Measurements (MEAS_U1_3.2)
MPPT_Meas_V: Top/MPPT X/MPPTX Interface to uC (MPPT_R1_1.2 MPPT_U3_1.6), Top/MPPT X/MPPTX Measurements (MEAS_C1_1.1 MEAS_R2_1.2 MEAS_R4_1.1)
MPPT_Meas_V: Top/MPPT Y+/MPPTY Interface to uC (MPPT_R1_2.2 MPPT_U3_2.6), Top/MPPT Y+/MPPTY Measurements (MEAS_C1_2.1 MEAS_R2_2.2 MEAS_R4_2.1)
MPPT_Meas_V: Top/MPPT Y-/MPPTY Interface to uC (MPPT_R1_3.2 MPPT_U3_3.6), Top/MPPT Y-/MPPTY Measurements (MEAS_C1_3.1 MEAS_R2_3.2 MEAS_R4_3.1)
MPPT_SCLK: EPS_CTRL_A (CTRLA_R4.2), Top/MPPT X/MPPTX Interface to uC (MPPT_U2_1.5 MPPT_U3_1.10)
MPPT_SCLK: EPS_CTRL_A (CTRLA_R13.2), Top/MPPT Y+/MPPTY Interface to uC (MPPT_U2_2.5 MPPT_U3_2.10)
MPPT_SCLK: EPS_CTRL_A (CTRLA_R25.2), Top/MPPT Y-/MPPTY Interface to uC (MPPT_U2_3.5 MPPT_U3_3.10)
NetBATC_R1_1: EPS_Battery_Controller_Current-Meas (BATC_R1.1), EPS_Battery_Controller_RLCL (5 pins)
NetBATV_R1_1: EPS_Connectors (H9.1 H9.2 H9.9 H9.10), EPS_Battery_Controller_Voltage-Meas (BATV_R1.1 BATV_R3.1), EPS_Battery_Controller_RLCL (RLCLB_C5.1 RLCLB_R4.2 RLCLB_R14.2 RLCLB_U1.8)
NetCTRL_C3_1_1: EPS_CTRL_A (U4.64), Top/Controller A/CTRL-A_Supply (CTRL_C3_1.1 CTRL_C4_1.1 CTRL_FB1_1.2)
NetCTRL_C3_2_1: EPS_CTRL_B (CTRLB_U1.27), Top/Controller B/CTRL-B_Supply (CTRL_C3_2.1 CTRL_C4_2.1 CTRL_FB1_2.2)
NetCTRL_C5_1_1: EPS_CTRL_A (U4.62), Top/Controller A/CTRL-A_Supply (CTRL_C5_1.1 CTRL_C6_1.1 CTRL_R1_1.1 CTRL_REF1_1.1)
NetCTRLA_J3_1: EPS_Connectors (H9.6), EPS_CTRL_A (CTRLA_J3.1)
NetCTRLA_R16_1: EPS_Connectors (H9.7), EPS_CTRL_A (CTRLA_R16.1)
NetCTRLA_R16_2: EPS_Connectors (H9.15), EPS_CTRL_A (CTRLA_R16.2)
NetCTRLA_R16_3: EPS_Connectors (H9.5), EPS_CTRL_A (CTRLA_R16.3)
NetCTRLA_R16_4: EPS_Connectors (H9.13), EPS_CTRL_A (CTRLA_R16.4)
NetCTRLA_R17_2: EPS_Connectors (H9.14), EPS_CTRL_A (CTRLA_R17.2)
NetCTRLA_R21_1: EPS_CTRL_A (CTRLA_R21.1), Top/Controller A/Temperature-Sensor (TEMP_C1_1.1 TEMP_U1_1.1 TEMP_U1_1.4 TEMP_U1_1.5)
NetCTRLB_C5_1: EPS_Connectors (H9.8), EPS_CTRL_B (CTRLB_C5.1 CTRLB_R9.1 CTRLB_R11.1)
NetCTRLB_R10_1: EPS_CTRL_B (CTRLB_R10.1), Top/Controller B/Temperature-Sensor (TEMP_C1_7.1 TEMP_U1_7.1 TEMP_U1_7.4 TEMP_U1_7.5)
NetCTRLB_U1_1: Top/MPPT X/MPPTX Interface to uC (MPPT_R16_1.2 MPPT_U5_1.5), EPS_CTRL_B (CTRLB_U1.1)
NetCTRLB_U1_2: Top/MPPT Y+/MPPTY Interface to uC (MPPT_R16_2.2 MPPT_U5_2.5), EPS_CTRL_B (CTRLB_U1.2)
NetCTRLB_U1_3: Top/MPPT Y-/MPPTY Interface to uC (MPPT_R16_3.2 MPPT_U5_3.5), EPS_CTRL_B (CTRLB_U1.3)
NetCTRLB_U1_13: EPS_DCDC_RLCLs (SEL_R5.1), EPS_CTRL_B (CTRLB_U1.13)
NetCTRLB_U1_14: EPS_DCDC_RLCLs (SEL_R7.2), EPS_CTRL_B (CTRLB_U1.14)
NetCTRLB_U1_19: EPS_CTRL_B (CTRLB_U1.19), Top/Controller B/I2C Repeater (RPT_R3_2.2)
NetCTRLB_U1_20: EPS_CTRL_B (CTRLB_U1.20), Top/Controller B/I2C Repeater (RPT_R5_2.2)
NetCTRLB_U1_42: Top/Local-Supply and WDTs/Local-Supply CTRL-B (SUPP_R13_2.2), EPS_CTRL_B (CTRLB_U1.42)
NetDCDCX_C1_2: EPS_MPPT_X_Boost-Converter (6 pins), EPS_MPPT_X_EMI-Filter_In (EMIXI_L1.1 EMIXI_L2.1 EMIXI_R2.2)
NetDCDCX_R7_2: EPS_MPPT_X_Boost-Converter (DCDCX_R7.2), Top/MPPT X/MPPTX Interface to uC (MPPT_C4_1.2 MPPT_R4_1.1 MPPT_U1_1.1)
NetDCDCY_C3_1_2: Top/MPPT Y+/MPPTY Buck-Boost Converter (6 pins), Top/MPPT Y+/MPPTY Input EMI Filter (EMIYI_L1_1.1 EMIYI_L2_1.1 EMIYI_R2_1.2)
NetDCDCY_C3_2_2: Top/MPPT Y-/MPPTY Buck-Boost Converter (6 pins), Top/MPPT Y-/MPPTY Input EMI Filter (EMIYI_L1_2.1 EMIYI_L2_2.1 EMIYI_R2_2.2)
NetDCDCY_C4_1_2: Top/MPPT Y+/MPPTY Buck-Boost Converter (6 pins), Top/MPPT Y+/MPPTY Output EMI Filter (EMIYO_FB1_1.2)
NetDCDCY_C4_2_2: Top/MPPT Y-/MPPTY Buck-Boost Converter (6 pins), Top/MPPT Y-/MPPTY Output EMI Filter (EMIYO_FB1_2.2)
NetDCDCY_R7_1_1: Top/MPPT Y+/MPPTY Buck-Boost Converter (DCDCY_R7_1.1), Top/MPPT Y+/MPPTY Interface to uC (MPPT_C4_2.2 MPPT_R4_2.1 MPPT_U1_2.1)
NetDCDCY_R7_2_1: Top/MPPT Y-/MPPTY Buck-Boost Converter (DCDCY_R7_2.1), Top/MPPT Y-/MPPTY Interface to uC (MPPT_C4_3.2 MPPT_R4_3.1 MPPT_U1_3.1)
NetDISTR_R1_2: EPS_Distribution (DISTR_R1.2), Top/Distribution/LCL-FPF SunS 3V3 (LCL_U1_1.3)
NetDISTR_R2_2: EPS_Distribution (DISTR_R2.2), Top/Distribution/LCL-FPF CAMnadir 3V3 (LCL_U1_2.3)
NetDISTR_R3_2: EPS_Distribution (DISTR_R3.2), Top/Distribution/LCL-FPF CAMwing 3V3 (LCL_U1_3.3)
NetDISTR_R4_2: EPS_Distribution (DISTR_R4.2), Top/Distribution/LCL-FPF SENS 5V (LCL_U1_4.3)
NetDISTR_R5_2: EPS_Distribution (DISTR_R5.2), Top/Distribution/LCL-FPF ANTs 5V (LCL_U1_5.3)
NetDISTR_R6_2: EPS_Distribution (DISTR_R6.2), Top/Distribution/LCL-FPF ANTs 5V (LCL_U1_6.3)
NetDISTR_R7_2: EPS_Distribution (DISTR_R7.2), Top/Distribution/RLCL-FPF 3V3 (RLCL_U1_2.3)
NetDISTR_R8_2: EPS_Distribution (DISTR_R8.2), Top/Distribution/RLCL-FPF 5V (RLCL_U1_1.3)
NetDRLCL_C1_1_1: EPS_RBL (RBL_Q1.D RBL_Q3.D), Top/Distribution/LCL-TK MAIN (5 pins), Top/Distribution/LCL-TK Redundant (5 pins), Top/LCLs for DCDC/DCDC RLCL (DRLCL_C1_1.1 DRLCL_C2_1.1 DRLCL_C3_1.1 DRLCL_U1_1.1), Top/LCLs for DCDC/VBAT RLCL (DRLCL_C1_2.1 DRLCL_C2_2.1 DRLCL_C3_2.1 DRLCL_U1_2.1), EPS_Local-Supply (LS_FB1.1 LS_FB2.1)
NetDRLCL_U1_1_4: EPS_DCDC_RLCLs (6 pins), Top/LCLs for DCDC/DCDC RLCL (DRLCL_U1_1.4), Top/LCLs for DCDC/VBAT RLCL (DRLCL_U1_2.4)
NetEMIBB_C1_1: EPS_5V_EMI-Filter_Out (5 pins), Top/Distribution/5V Measurements (HK_R1_1.4)
NetEMIXI_C1_1: Top/MPPT X/MPPTX Measurements (MEAS_R1_1.4), EPS_MPPT_X_EMI-Filter_In (EMIXI_C1.1 EMIXI_L2.2 EMIXI_R1.1)
NetEMIYI_C1_1_1: Top/MPPT Y+/MPPTY Measurements (MEAS_R1_2.4), Top/MPPT Y+/MPPTY Input EMI Filter (EMIYI_C1_1.1 EMIYI_L2_1.2 EMIYI_R1_1.1)
NetEMIYI_C1_2_1: Top/MPPT Y-/MPPTY Measurements (MEAS_R1_3.4), Top/MPPT Y-/MPPTY Input EMI Filter (EMIYI_C1_2.1 EMIYI_L2_2.2 EMIYI_R1_2.1)
NetEMIYO_C1_1_1: Top/MPPT Y+/MPPTY Interface to uC (MPPT_R13_2.2), Top/MPPT Y+/MPPTY Output EMI Filter (EMIYO_C1_1.1 EMIYO_C2_1.1 EMIYO_FB1_1.1 EMIYO_R1_1.2), Top/MPPT Y+/MPPTY ORing to MPB (SUMPB_U1_1.1 SUMPBY_C1_1.1 SUMPBY_C2_1.1 SUMPBY_Q1_1.D)
NetEMIYO_C1_2_1: Top/MPPT Y-/MPPTY Interface to uC (MPPT_R13_3.2), Top/MPPT Y-/MPPTY Output EMI Filter (EMIYO_C1_2.1 EMIYO_C2_2.1 EMIYO_FB1_2.1 EMIYO_R1_2.2), Top/MPPT Y-/MPPTY ORing to MPB (SUMPB_U1_2.1 SUMPBY_C1_2.1 SUMPBY_C2_2.1 SUMPBY_Q1_2.D)
NetEMIYS_T1_1_1: EPS_Connectors (H7.1 H7.5), Top/MPPT Y+/MPPTY EMI Filters for Solar Panels (EMIYS_T1_1.1)
NetEMIYS_T1_1_2: EPS_Connectors (H7.2 H7.6), Top/MPPT Y+/MPPTY EMI Filters for Solar Panels (EMIYS_T1_1.2)
NetEMIYS_T1_2_1: EPS_Connectors (H6.1 H6.5), Top/MPPT Y-/MPPTY EMI Filters for Solar Panels (EMIYS_T1_2.1)
NetEMIYS_T1_2_2: EPS_Connectors (H6.2 H6.6), Top/MPPT Y-/MPPTY EMI Filters for Solar Panels (EMIYS_T1_2.2)
NetH5_2: EPS_Connectors (H5.2), EPS_RBL (6 pins)
NetH8_1: EPS_Connectors (H8.1 H8.6), Top/Distribution/LCL-FPF ANTs 5V (LCL_C2_5.1 LCL_R1_5.2 LCL_U1_5.8), Top/Distribution/LCL-FPF ANTs 5V (LCL_C2_6.1 LCL_R1_6.2 LCL_U1_6.8)
NetH9_16: EPS_Connectors (H9.16), EPS_Battery_Heaters-Control (HTR_R2.1)
NetHK_R1_1_1: Top/Distribution/LCL-FPF SENS 5V (LCL_C1_4.1 LCL_C4_4.1 LCL_C5_4.1 LCL_U1_4.1), Top/Distribution/RLCL-FPF 5V (RLCL_C1_1.1 RLCL_U1_1.1), Top/Distribution/5V Measurements (HK_R1_1.1 HK_R3_1.1), Top/Distribution/LCL-FPF ANTs 5V (LCL_C1_5.1 LCL_C4_5.1 LCL_C5_5.1 LCL_U1_5.1), Top/Distribution/LCL-FPF ANTs 5V (LCL_C1_6.1 LCL_C4_6.1 LCL_C5_6.1 LCL_U1_6.1)
NetHK_R1_2_1: Top/Distribution/LCL-FPF SunS 3V3 (LCL_C1_1.1 LCL_C4_1.1 LCL_C5_1.1 LCL_U1_1.1), Top/Distribution/LCL-FPF CAMnadir 3V3 (LCL_C1_2.1 LCL_C4_2.1 LCL_C5_2.1 LCL_U1_2.1), Top/Distribution/LCL-FPF CAMwing 3V3 (LCL_C1_3.1 LCL_C4_3.1 LCL_C5_3.1 LCL_U1_3.1), Top/Distribution/3V3 Measurements (HK_R1_2.1 HK_R3_2.1), Top/Distribution/RLCL-FPF 3V3 (RLCL_C1_2.1 RLCL_U1_2.1)
NetLS_C1_1: EPS_Local-Supply (LS_C1.1 LS_FB1.2 LS_FB2.2 LS_R2.1), Top/Local-Supply and WDTs/Local-Supply CTRL-A (SUPP_C4_1.1 SUPP_U1_1.1 SUPP_U1_1.3), Top/Local-Supply and WDTs/Local-Supply CTRL-B (SUPP_C4_2.1 SUPP_U1_2.1 SUPP_U1_2.3)
NetMPPT_R13_1_2: Top/MPPT X/MPPTX Interface to uC (MPPT_R13_1.2), EPS_MPPT_X_OR_MPB (5 pins)
NetRPT_R3_1_2: EPS_CTRL_A (U4.25), Top/Controller A/I2C Repeater (RPT_R3_1.2)
NetRPT_R5_1_2: EPS_CTRL_A (U4.26), Top/Controller A/I2C Repeater (RPT_R5_1.2)
NetSEL_R4_1: EPS_CTRL_A (U4.14), EPS_DCDC_RLCLs (SEL_R4.1)
NetSEL_R6_2: EPS_CTRL_A (U4.15), EPS_DCDC_RLCLs (SEL_R6.2)
NetSUPP_R13_1_2: EPS_CTRL_A (U4.17), Top/Local-Supply and WDTs/Local-Supply CTRL-A (SUPP_R13_1.2)
NetTEMP_C1_2_1: EPS_3V3 (TEMP_R4.1), Top/3V3/Temperature-Sensor (TEMP_C1_2.1 TEMP_U1_2.1 TEMP_U1_2.4 TEMP_U1_2.5)
NetTEMP_C1_3_1: EPS_5V (TEMP_R1.1), Top/5V/Temperature-Sensor (TEMP_C1_3.1 TEMP_U1_3.1 TEMP_U1_3.4 TEMP_U1_3.5)
NetTEMP_C1_4_1: Top/Local-Supply and WDTs/Local-Supply CTRL-A (TEMP_R5_1.1), Top/Local-Supply and WDTs/Local-Supply CTRL-A/Temperature-Sensor (TEMP_C1_4.1 TEMP_U1_4.1 TEMP_U1_4.4 TEMP_U1_4.5)
NetTEMP_C1_5_1: Top/Local-Supply and WDTs/Local-Supply CTRL-B (TEMP_R5_2.1), Top/Local-Supply and WDTs/Local-Supply CTRL-B/Temperature-Sensor (TEMP_C1_5.1 TEMP_U1_5.1 TEMP_U1_5.4 TEMP_U1_5.5)
NetTEMP_C1_6_1: EPS_Battery (TEMP_R2.1), Top/Battery Pack/Temperature-Sensor (TEMP_C1_6.1 TEMP_U1_6.1 TEMP_U1_6.4 TEMP_U1_6.5)
PC-104_EXTY+: Top/MPPT Y+/MPPTY EMI Filters for Solar Panels (EMIYS_FB1_1.2), EPS_Connectors_PC-104 (H1.15)
PC-104_EXTY-: Top/MPPT Y-/MPPTY EMI Filters for Solar Panels (EMIYS_FB1_2.2), EPS_Connectors_PC-104 (H1.17)
PC-104_I2C-Bus_SCL: EPS_Connectors (H8.7), Top/Controller A/I2C Repeater (RPT_R4_1.2), EPS_Connectors_PC-104 (H1.43)
PC-104_I2C-Bus_SDA: EPS_Connectors (H8.2), Top/Controller A/I2C Repeater (RPT_R6_1.2), EPS_Connectors_PC-104 (H1.41)
PC-104_I2C-Payload_SCL: EPS_Connectors (H8.8), Top/Controller B/I2C Repeater (RPT_R4_2.2), EPS_Connectors_PC-104 (H1.21)
PC-104_I2C-Payload_SDA: EPS_Connectors (H8.4), Top/Controller B/I2C Repeater (RPT_R6_2.2), EPS_Connectors_PC-104 (H1.23)
PC-104_Kill-Switch_Pri: EPS_Connectors (H3.2 H4.2), EPS_MPPT_X_OR_MPB (7 pins), Top/MPPT Y+/MPPTY ORing to MPB (6 pins), EPS_Battery_Controller_Current-Meas (BATC_R1.4), Top/MPPT Y-/MPPTY ORing to MPB (6 pins), EPS_Connectors_PC-104 (H1.9)
PC-104_Kill-Switch_Sec: EPS_Connectors (H3.1 H4.1), EPS_RBL (8 pins), EPS_Connectors_PC-104 (H1.11)
PC-104_LCL_3V3: Top/Distribution/RLCL-FPF 3V3 (RLCL_C2_2.1 RLCL_R1_2.2 RLCL_R4_2.2 RLCL_U1_2.8), EPS_Connectors_PC-104 (5 pins)
PC-104_LCL_5V: Top/Distribution/RLCL-FPF 5V (RLCL_C2_1.1 RLCL_R1_1.2 RLCL_R4_1.2 RLCL_U1_1.8), EPS_Connectors_PC-104 (H2.25 H2.26)
PC-104_LCL_CAMnadir_3V3: Top/Distribution/LCL-FPF CAMnadir 3V3 (LCL_C2_2.1 LCL_R1_2.2 LCL_U1_2.8), EPS_Connectors_PC-104 (H2.37)
PC-104_LCL_CAMwing_3V3: Top/Distribution/LCL-FPF CAMwing 3V3 (LCL_C2_3.1 LCL_R1_3.2 LCL_U1_3.8), EPS_Connectors_PC-104 (H2.35)
PC-104_LCL_SADSmain: Top/Distribution/LCL-TK MAIN (LCLTK_Q3_1.D), EPS_Connectors_PC-104 (H1.39)
PC-104_LCL_SADSred: Top/Distribution/LCL-TK Redundant (LCLTK_Q3_2.D), EPS_Connectors_PC-104 (H1.40)
PC-104_LCL_SAILmain: Top/Distribution/LCL-TK MAIN (LCLTK_Q1_1.D), EPS_Connectors_PC-104 (H1.37)
PC-104_LCL_SAILred: Top/Distribution/LCL-TK Redundant (LCLTK_Q1_2.D), EPS_Connectors_PC-104 (H1.38)
PC-104_LCL_SENS_5V: Top/Distribution/LCL-FPF SENS 5V (LCL_C2_4.1 LCL_R1_4.2 LCL_U1_4.8), EPS_Connectors_PC-104 (H1.35)
PC-104_LCL_SunS_3V3: Top/Distribution/LCL-FPF SunS 3V3 (LCL_C2_1.1 LCL_R1_1.2 LCL_U1_1.8), EPS_Connectors_PC-104 (H2.39)
PC-104_LCL_VBAT: Top/Distribution/VBAT Measurements (HK_R1_3.1 HK_R3_3.1), EPS_Connectors_PC-104 (H2.45 H2.46)